# Altium schematic sheet SinWaveAmplifier.SchDoc
size A4
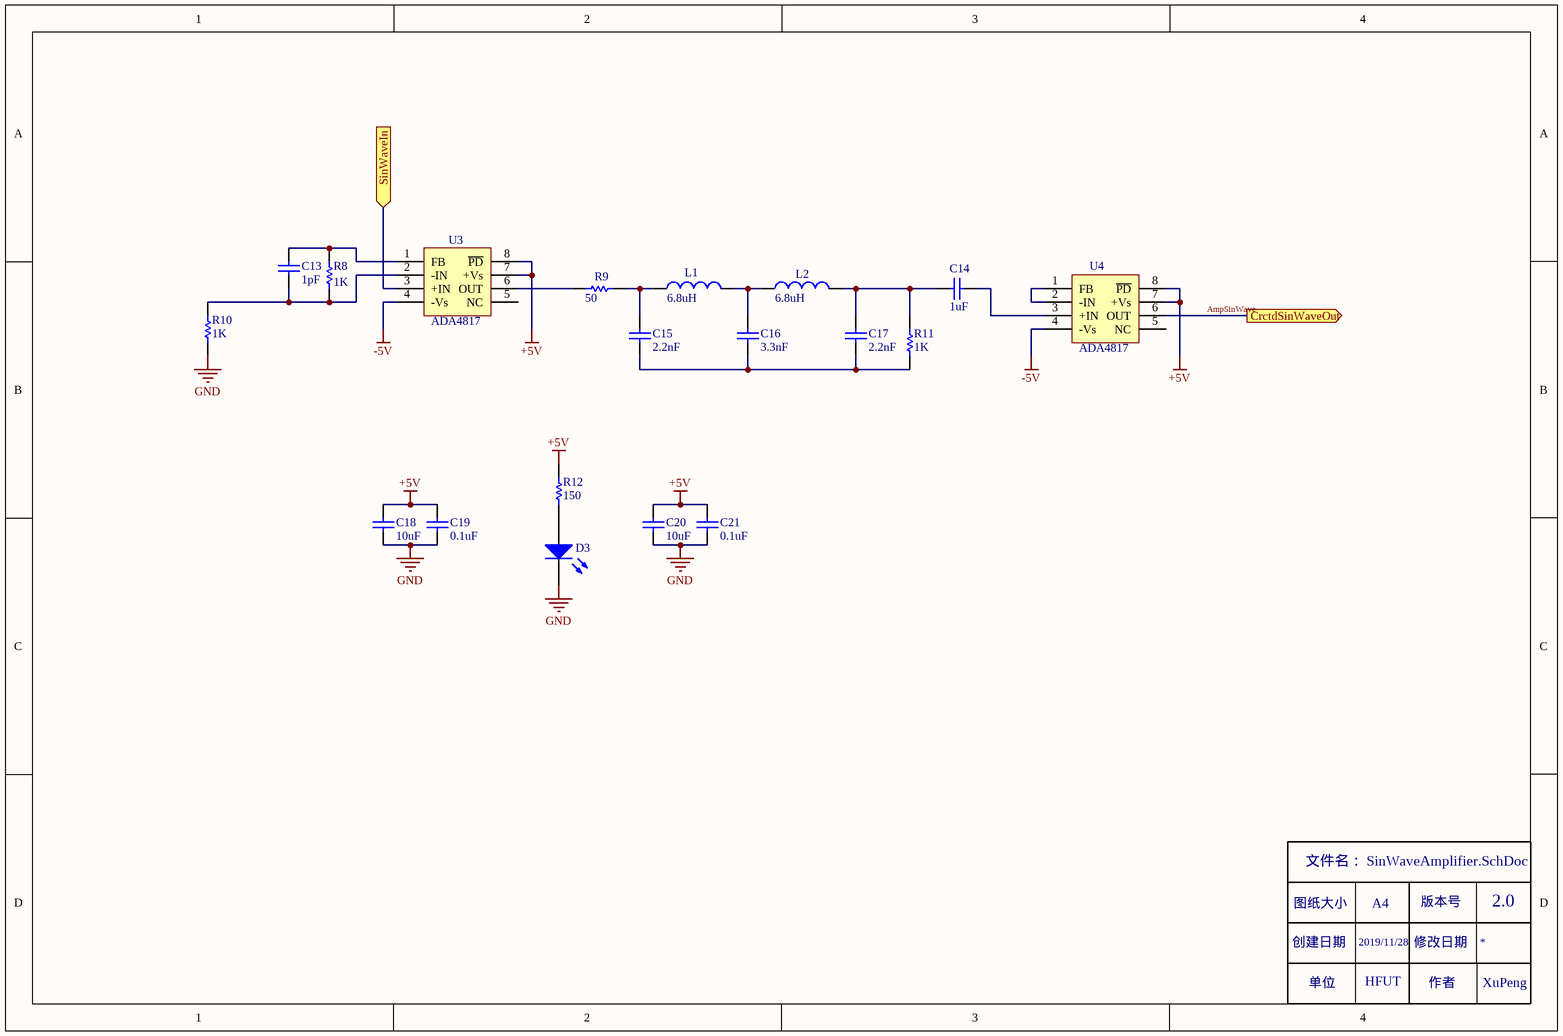
[diagram p0: SinWaveAmplifier.SchDoc]

## Parts
C13  value 1pF  [C-RAD]  (hidden comment: Cap)
C14  value 1uF  [C-RAD]  (hidden comment: Cap)
C15  value 2.2nF  [C-RAD]  (hidden comment: Cap)
C16  value 3.3nF  [C-RAD]  (hidden comment: Cap)
C17  value 2.2nF  [C-RAD]  (hidden comment: Cap)
C18  value 10uF  [RB0.1/0.2]  (hidden comment: Cap)
C19  value 0.1uF  [C-RAD]  (hidden comment: Cap)
C20  value 10uF  [RB0.1/0.2]  (hidden comment: Cap)
C21  value 0.1uF  [C-RAD]  (hidden comment: Cap)
D3  LED0  [RB2.54/4]  (value not drawn)
L1  value 6.8uH  [PK0608-2.8/7]  (hidden comment: Inductor)
L2  value 6.8uH  [PK0608-2.8/7]  (hidden comment: Inductor)
R8  value 1K  [AXIAL-0.3]  (hidden comment: Res1)
R9  value 50  [AXIAL-0.3]  (hidden comment: Res1)
R10  value 1K  [AXIAL-0.3]  (hidden comment: Res1)
R11  value 1K  [AXIAL-0.3]  (hidden comment: Res1)
R12  value 150  [AXIAL-0.3]  (hidden comment: Res1)
U3  ADA4817  [SOP8]
U4  ADA4817  [SOP8]

## Ports
CrctdSinWaveOut (out), SinWaveIn (in)

## Nets
+5V: C18.2 C19.2 C20.2 C21.2 R12.2 U3.7(+Vs) U3.8(~{PD}) U4.7(+Vs) U4.8(~{PD})
-5V: U3.4(-Vs) U4.4(-Vs)
GND: C18.1 C19.1 C20.1 C21.1 D3.2(K) R10.1
AmpSinWave: U4.6(OUT) ; port CrctdSinWaveOut
SinWaveIn: U3.3(+IN) ; port SinWaveIn
NetC13_1: C13.1 R8.1 R10.2 U3.2(-IN)
NetC13_2: C13.2 R8.2 U3.1(FB)
NetC14_1: C14.1 C17.2 L2.2 R11.2
NetC14_2: C14.2 U4.3(+IN)
NetC15_1: C15.1 C16.1 C17.1 R11.1
NetC15_2: C15.2 L1.1 R9.2
NetC16_2: C16.2 L1.2 L2.1
NetD3_1: D3.1(A) R12.1
NetR9_1: R9.1 U3.6(OUT)
NetU4_1: U4.1(FB) U4.2(-IN)

Not connected (* = marked no-connect by the designer): U3 5(NC); U4 5(NC)

## Notes on the sheet
- 2.0
- 图纸大小
- 文件名：
- A4
- 版本号
- 创建日期
- 单位
- 2019/11/28
- HFUT
- 修改日期
- 作者
- XuPeng

## Library data of the parts
C13-C21 = Cap: 无极性电容; Published: 8-Jun-2000; PackageReference: RAD-0.3; Publisher: Altium Limited; LatestRevisionDate: 17-Jul-2002; LatestRevisionNote: Re-released for DXP Platform.
D3 = LED0: Typical INFRARED GaAs LED; Published: 8-Jun-2000; LatestRevisionDate: 08-Jul-2005; LatestRevisionNote: Mech Layer 1 removed.; PackageReference: LED-0; Publisher: Altium Limited; PackageDescription: LED; 2 Leads
L1 L2 = Inductor: Code_IEC: 1005; Published: 8-Jun-2000; LatestRevisionDate: 29-May-2009; LatestRevisionNote: IPC-7351 Footprint Added.; PackageReference: 0402-A; Publisher: Altium Limited; PackageDescription: Chip Inductor; Code_JEITA: 0402
R8-R12 = Res1: Resistor; Published: 8-Jun-2000; LatestRevisionDate: 17-Jul-2002; LatestRevisionNote: Re-released for DXP Platform.; PackageReference: AXIAL-0.3; Publisher: Altium Limited; PackageDescription: Axial Device, Thru-Hole; 2 Leads; 0.3 in Pin Spacing